# Altium schematic sheet Power.SchDoc
size A4; Author: ALTIUM GOSTBOM2.0 KEV; SheetNumber: 5; SheetTotal: 7
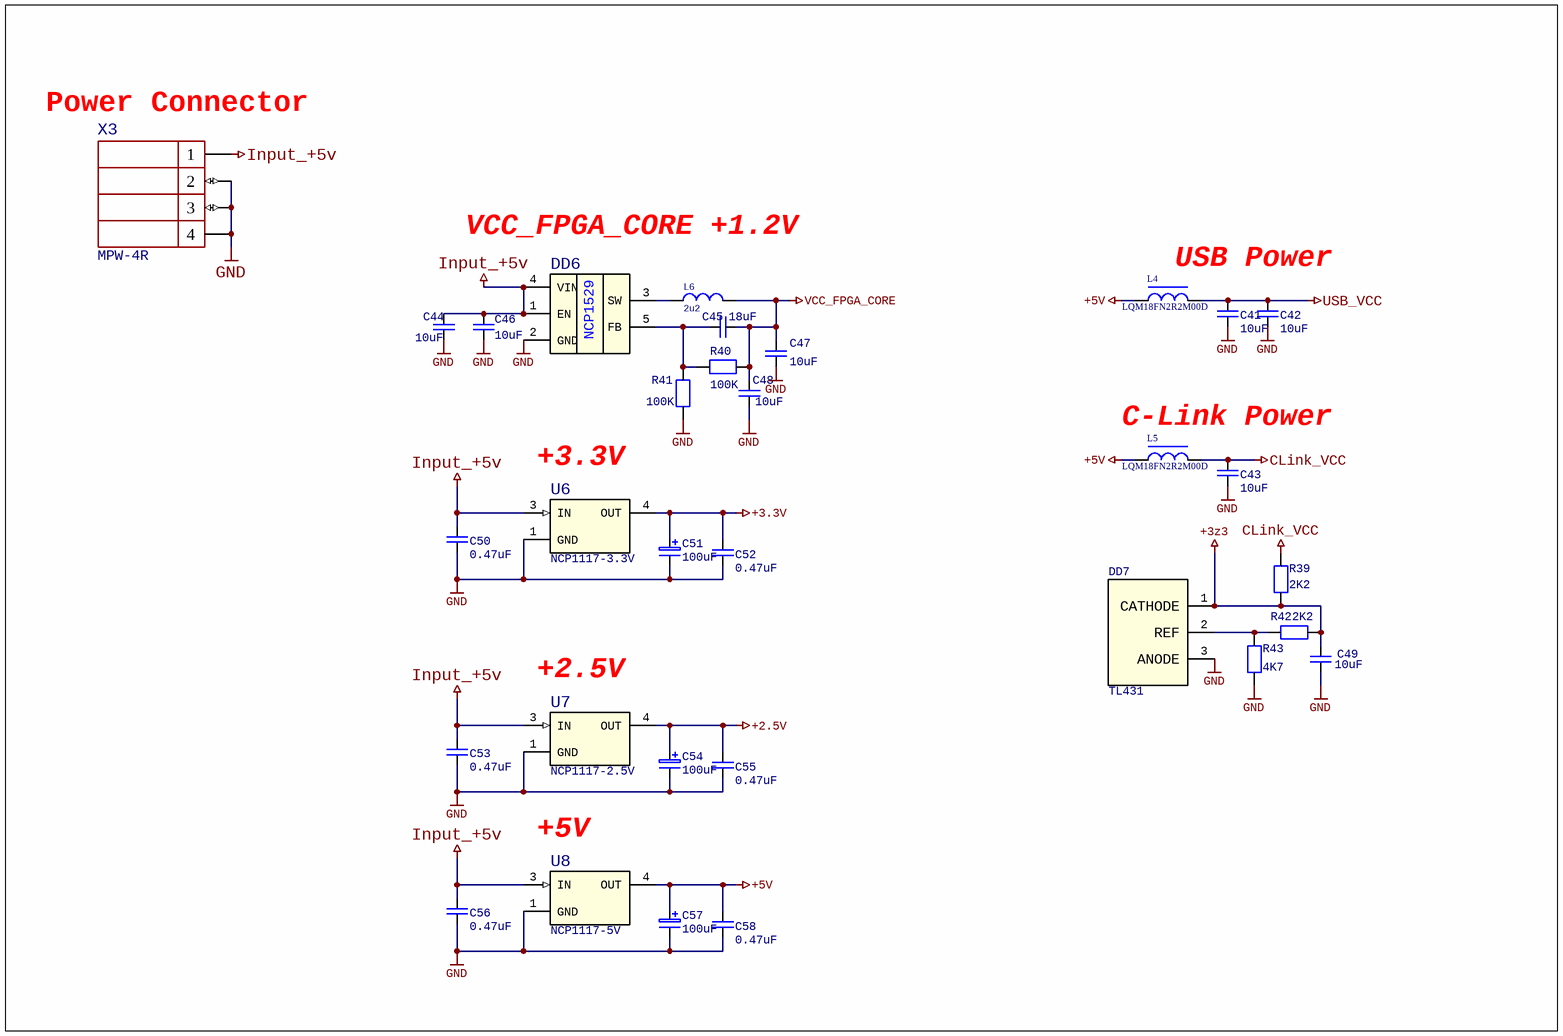
[diagram p0: Power.SchDoc]

## Parts
C41  10uF  [C_0603]
C42  10uF  [C_0603]
C43  10uF  [C_0603]
C44  10uF  [C_0603]
C45  18uF  [C_0603]
C46  10uF  [C_0603]
C47  10uF  [C_0603]
C48  10uF  [C_0603]
C49  10uF  [C_0603]
C50  0.47uF  [C_0603]
C51  100uF  [SMD D]
C52  0.47uF  [C_0603]
C53  0.47uF  [C_0603]
C54  100uF  [SMD D]
C55  0.47uF  [C_0603]
C56  0.47uF  [C_0603]
C57  100uF  [SMD D]
C58  0.47uF  [C_0603]
DD6  NCP1529  [SOT-23-5]  (value not drawn)
DD7  TL431  [SOT-23]
L4  LQM18FN2R2M00D  [L_0603]
L5  LQM18FN2R2M00D  [L_0603]
L6  2u2  [L_1008]
R39  2K2  [R_0603]
R40  100K  [R_0603]
R41  100K  [R_0603]
R42  2K2  [R_0603]
R43  4K7  [R_0603]
U6  NCP1117-3.3V  [TO-252]
U7  NCP1117-2.5V  [TO-252]
U8  NCP1117-5V  [TO-252]
X3  MPW-4R  [MPW-4R]

## Nets
+2.5V: C54.1 C55.1 U7.4(OUT)
+3.3V: C51.1 C52.1 U6.4(OUT)
+3z3: C49.1 DD7.1(CATHODE) R39.1 R42.2
+5V: C57.1 C58.1 L4.1 L5.1 U8.4(OUT)
CLink_VCC: C43.1 L5.2 R39.2
GND: C41.2 C42.2 C43.2 C44.2 C46.2 C47.1 C48.1 C49.2 C50.2 C51.2 C52.2 C53.2 C54.2 C55.2 C56.2 C57.2 C58.2 DD6.2(GND) DD7.3(ANODE) R41.2 R43.2 U6.1(GND) U7.1(GND) U8.1(GND) X3.2 X3.3 X3.4
Input_+5v: C44.1 C46.1 C50.1 C53.1 C56.1 DD6.1(EN) DD6.4(VIN) U6.3(IN) U7.3(IN) U8.3(IN) X3.1
USB_VCC: C41.1 C42.1 L4.2
VCC_FPGA_CORE: C45.2 C47.2 C48.2 L6.2 R40.2
NetC45_1: C45.1 DD6.5(FB) R40.1 R41.1
NetDD6_3: DD6.3(SW) L6.1
NetDD7_2: DD7.2(REF) R42.1 R43.1

## Notes on the sheet
- (near X3) Power Connector
- VCC_FPGA_CORE +1.2V
- USB Power
- C-Link Power
- (near U6) +3.3V
- (near U7) +2.5V
- +5V
- Перв. примен.
- Справ. №
- Подп. дата
- Инв. № дубл.
- Взам. инв. №
- Подп. и дата
- Изм.
- Разраб.
- Лист
- № докум.
- Подп.
- Дата
- Лит.
- Масса
- Масштаб
- Пров.
- Т.контр.
- Листов
- Инв. № подл.
- Н.контр.
- Утв.
- ALTIUM GOSTBOM2.0 KEV
- Файл:
- Копировал
- Формат А3

## Library data of the parts
C41-C50 C52 C53 C55 C56 C58 = C: Non-polarised capacitor; ComponentLink1Description: Manufacturer Link; ComponentLink1URL: www.murata.com; ComponentLink2Description: Datasheet Link; ComponentLink2URL: http://www.murata.com/products/catalog/pdf/c02e.pdf; ValueSCH: *
C51 C54 C57 = C_polar: Polarised capacitor; ComponentLink1Description: Manufacturer Link; ComponentLink1URL: www.murata.com; ComponentLink2Description: Datasheet Link; ComponentLink2URL: http://www.murata.com/products/catalog/pdf/c02e.pdf; ValueSCH: *
L4 L5 = L
L6 = L_2
R39-R43 = R
U6-U8 = NCP1117: 1.5 V,1.8 V, 1.9 V, 2.0 V, 2.5 V, 2.85 V, 3.3 V, 5.0 V,12 V
X3 = MPW-4R: Разъемы низковольтного питания